# EAGLE design NEW Battery Manager V1 (EAGLE 5.12)

## Sheet 1 of 2
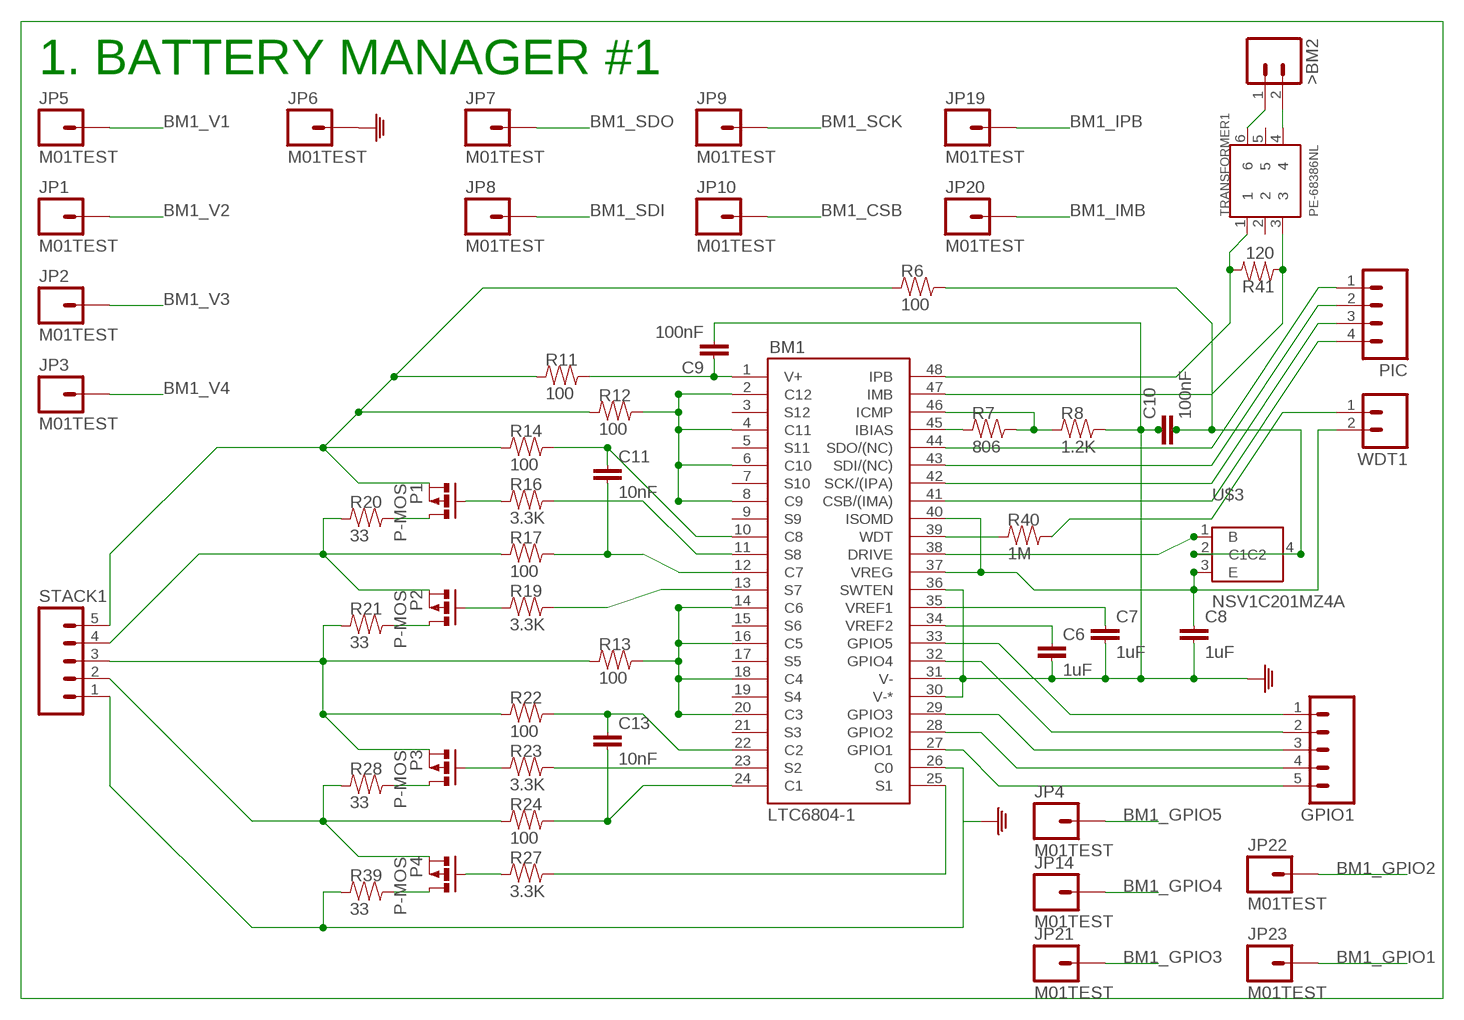
[diagram p0: schematic, sheet 1]

### Parts
>BM2  M02PTH  [1X02]
BM1  LTC6804-1  [SSOP-48]
C6  1uF  CAP0603  [0603]
C7  1uF  CAP0603  [0603]
C8  1uF  CAP0603  [0603]
C9  100nF  CAP0603  [0603]
C10  100nF  CAP0603  [0603]
C11  10nF  CAP0603  [0603]
C13  10nF  CAP0603  [0603]
GPIO1  M05PTH  [1X05]
JP1  M01TEST  [1X01_TEST]
JP2  M01TEST  [1X01_TEST]
JP3  M01TEST  [1X01_TEST]
JP4  M01TEST  [1X01_TEST]
JP5  M01TEST  [1X01_TEST]
JP6  M01TEST  [1X01_TEST]
JP7  M01TEST  [1X01_TEST]
JP8  M01TEST  [1X01_TEST]
JP9  M01TEST  [1X01_TEST]
JP10  M01TEST  [1X01_TEST]
JP14  M01TEST  [1X01_TEST]
JP19  M01TEST  [1X01_TEST]
JP20  M01TEST  [1X01_TEST]
JP21  M01TEST  [1X01_TEST]
JP22  M01TEST  [1X01_TEST]
JP23  M01TEST  [1X01_TEST]
P1  P-MOS  [SOT23F]
P2  P-MOS  [SOT23F]
P3  P-MOS  [SOT23F]
P4  P-MOS  [SOT23F]
PIC  M04PTH  [1X04]
R6  100  R0603  [0603]
R7  806  R0603  [0603]
R8  1.2K  R0603  [0603]
R11  100  R0603  [0603]
R12  100  R0603  [0603]
R13  100  R0603  [0603]
R14  100  R0603  [0603]
R16  3.3K  R0603  [0603]
R17  100  R0603  [0603]
R19  3.3K  R0603  [0603]
R20  33  R0603  [0603]
R21  33  R0603  [0603]
R22  100  R0603  [0603]
R23  3.3K  R0603  [0603]
R24  100  R0603  [0603]
R27  3.3K  R0603  [0603]
R28  33  R0603  [0603]
R39  33  R0603  [0603]
R40  1M  R0603  [0603]
R41  120  R0603  [0603]
STACK1  M05PTH  [1X05]
TRANSFORMER1  PE-68386NL  [NL]
U$3  NSV1C201MZ4A  [SOT-223]
WDT1  M02PTH  [1X02]

### Nets
BM1_CSB: BM1.41(CSB/(IMA)) JP10.1 PIC.4
BM1_GPIO1: BM1.27(GPIO1) GPIO1.5 JP23.1
BM1_GPIO2: BM1.28(GPIO2) GPIO1.4 JP22.1
BM1_GPIO3: BM1.29(GPIO3) GPIO1.3 JP21.1
BM1_GPIO4: BM1.32(GPIO4) GPIO1.2 JP14.1
BM1_GPIO5: BM1.33(GPIO5) GPIO1.1 JP4.1
BM1_IMB: BM1.47(IMB) JP20.1 R41.1 TRANSFORMER1.3
BM1_IPB: BM1.48(IPB) JP19.1 R41.2 TRANSFORMER1.1
BM1_SCK: BM1.42(SCK/(IPA)) JP9.1 PIC.3
BM1_SDI: BM1.43(SDI/(NC)) JP8.1 PIC.2
BM1_SDO: BM1.44(SDO/(NC)) JP7.1 PIC.1
BM1_V1: JP5.1 P1.S R6.1 R11.1 R12.1 R14.1 STACK1.5
BM1_V2: JP1.1 P2.S R17.1 R20.1 STACK1.4
BM1_V3: JP2.1 P3.S R13.1 R21.1 R22.1 STACK1.3
BM1_V4: JP3.1 P4.S R24.1 R28.1 STACK1.2
GND: BM1.26(C0) BM1.30(V-*) BM1.31(V-) BM1.36(SWTEN) C6.2 C7.2 C8.2 C9.2 C10.1 JP6.1 R8.2 R39.1 STACK1.1
N$7: BM1.46(ICMP) R7.2 R8.1
N$8: BM1.37(VREG) BM1.40(ISOMD) C8.1 U$3.3(E) WDT1.2
N$15: BM1.34(VREF2) C6.1
N$16: BM1.35(VREF1) C7.1
N$17: BM1.1(V+) C9.1 R11.2
N$18: BM1.2(C12) BM1.4(C11) BM1.6(C10) BM1.8(C9) R12.2
N$19: BM1.14(C6) BM1.16(C5) BM1.18(C4) BM1.20(C3) R13.2
N$20: BM1.10(C8) C11.1 R14.2
N$21: BM1.11(S8) R16.2
N$22: P1.G R16.1
N$23: BM1.13(S7) R19.2
N$24: P2.G R19.1
N$27: P1.D R20.2
N$28: P2.D R21.2
N$29: BM1.25(S1) R27.2
N$30: P3.G R23.1
N$31: P3.D R28.2
N$32: P4.G R27.1
N$33: P4.D R39.2
N$34: BM1.24(C1) C13.2 R24.2
N$35: BM1.23(S2) R23.2
N$37: BM1.12(C7) C11.2 R17.2
N$38: BM1.22(C2) C13.1 R22.2
N$40: C10.2 R6.2 U$3.2(C1) U$3.4(C2)
N$43: >BM2.1 TRANSFORMER1.6
N$54: >BM2.2 TRANSFORMER1.4
N$64: BM1.45(IBIAS) R7.1
N$70: BM1.39(WDT) R40.1
N$71: R40.2 WDT1.1
N$72: BM1.38(DRIVE) U$3.1(B)
Unconnected: BM1.3(S12) BM1.5(S11) BM1.7(S10) BM1.9(S9) BM1.15(S6) BM1.17(S5) BM1.19(S4) BM1.21(S3) TRANSFORMER1.2 TRANSFORMER1.5

### Notes on the sheet
- 1. BATTERY MANAGER #1

## Sheet 2 of 2
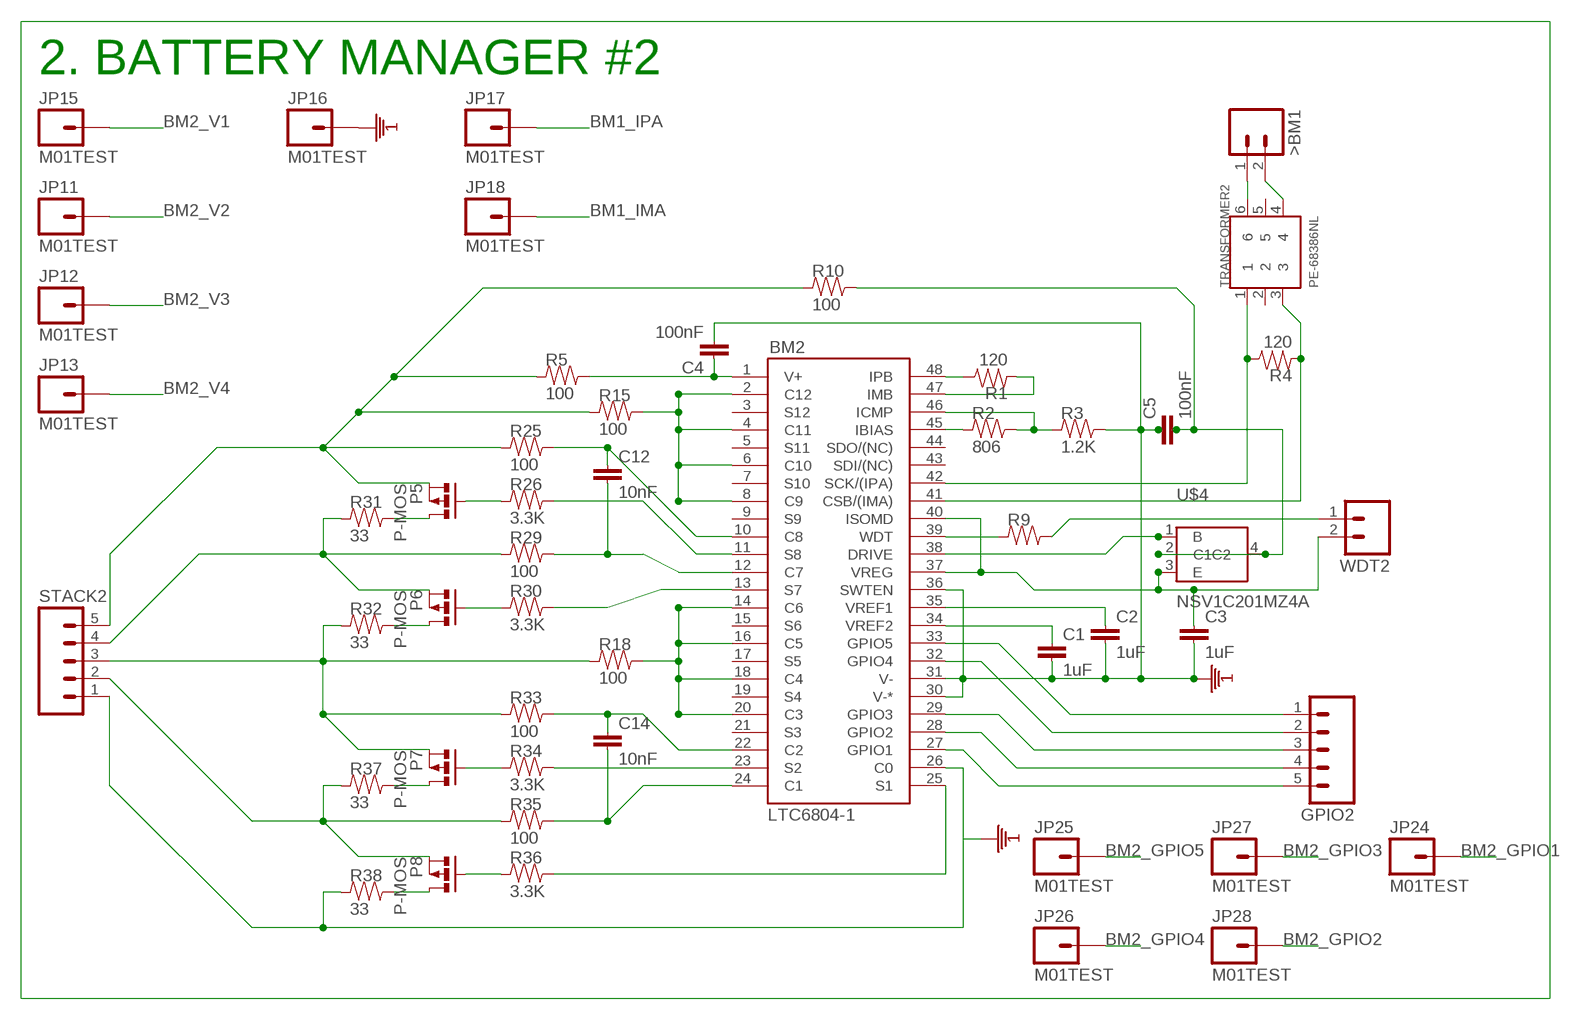
[diagram p1: schematic, sheet 2]

### Parts
>BM1  M02PTH  [1X02]
BM2  LTC6804-1  [SSOP-48]
C1  1uF  CAP0603  [0603]
C2  1uF  CAP0603  [0603]
C3  1uF  CAP0603  [0603]
C4  100nF  CAP0603  [0603]
C5  100nF  CAP0603  [0603]
C12  10nF  CAP0603  [0603]
C14  10nF  CAP0603  [0603]
GPIO2  M05PTH  [1X05]
JP11  M01TEST  [1X01_TEST]
JP12  M01TEST  [1X01_TEST]
JP13  M01TEST  [1X01_TEST]
JP15  M01TEST  [1X01_TEST]
JP16  M01TEST  [1X01_TEST]
JP17  M01TEST  [1X01_TEST]
JP18  M01TEST  [1X01_TEST]
JP24  M01TEST  [1X01_TEST]
JP25  M01TEST  [1X01_TEST]
JP26  M01TEST  [1X01_TEST]
JP27  M01TEST  [1X01_TEST]
JP28  M01TEST  [1X01_TEST]
P5  P-MOS  [SOT23F]
P6  P-MOS  [SOT23F]
P7  P-MOS  [SOT23F]
P8  P-MOS  [SOT23F]
R1  120  R0603  [0603]
R2  806  R0603  [0603]
R3  1.2K  R0603  [0603]
R4  120  R0603  [0603]
R5  100  R0603  [0603]
R9  R0603  [0603]
R10  100  R0603  [0603]
R15  100  R0603  [0603]
R18  100  R0603  [0603]
R25  100  R0603  [0603]
R26  3.3K  R0603  [0603]
R29  100  R0603  [0603]
R30  3.3K  R0603  [0603]
R31  33  R0603  [0603]
R32  33  R0603  [0603]
R33  100  R0603  [0603]
R34  3.3K  R0603  [0603]
R35  100  R0603  [0603]
R36  3.3K  R0603  [0603]
R37  33  R0603  [0603]
R38  33  R0603  [0603]
STACK2  M05PTH  [1X05]
TRANSFORMER2  PE-68386NL  [NL]
U$4  NSV1C201MZ4A  [SOT-223]
WDT2  M02PTH  [1X02]

### Nets
BM1_IMA: BM2.41(CSB/(IMA)) JP18.1 R4.1 TRANSFORMER2.3
BM1_IPA: BM2.42(SCK/(IPA)) JP17.1 R4.2 TRANSFORMER2.1
BM2_GPIO1: BM2.27(GPIO1) GPIO2.5 JP24.1
BM2_GPIO2: BM2.28(GPIO2) GPIO2.4 JP28.1
BM2_GPIO3: BM2.29(GPIO3) GPIO2.3 JP27.1
BM2_GPIO4: BM2.32(GPIO4) GPIO2.2 JP26.1
BM2_GPIO5: BM2.33(GPIO5) GPIO2.1 JP25.1
BM2_V1: JP15.1 P5.S R5.1 R10.1 R15.1 R25.1 STACK2.5
BM2_V2: JP11.1 P6.S R29.1 R31.1 STACK2.4
BM2_V3: JP12.1 P7.S R18.1 R32.1 R33.1 STACK2.3
BM2_V4: JP13.1 P8.S R35.1 R37.1 STACK2.2
GND1: BM2.26(C0) BM2.30(V-*) BM2.31(V-) BM2.36(SWTEN) C1.2 C2.2 C3.2 C4.2 C5.1 JP16.1 R3.2 R38.1 STACK2.1
N$1: BM2.46(ICMP) R2.2 R3.1
N$2: BM2.45(IBIAS) R2.1
N$3: >BM1.1 TRANSFORMER2.6
N$4: BM2.34(VREF2) C1.1
N$5: BM2.35(VREF1) C2.1
N$6: BM2.1(V+) C4.1 R5.2
N$9: BM2.2(C12) BM2.4(C11) BM2.6(C10) BM2.8(C9) R15.2
N$10: BM2.14(C6) BM2.16(C5) BM2.18(C4) BM2.20(C3) R18.2
N$11: BM2.10(C8) C12.1 R25.2
N$12: BM2.11(S8) R26.2
N$14: P5.G R26.1
N$25: BM2.13(S7) R30.2
N$36: P6.G R30.1
N$39: P5.D R31.2
N$41: P6.D R32.2
N$42: >BM1.2 TRANSFORMER2.4
N$44: BM2.25(S1) R36.2
N$45: P7.G R34.1
N$46: P7.D R37.2
N$47: P8.G R36.1
N$48: P8.D R38.2
N$49: BM2.24(C1) C14.2 R35.2
N$50: BM2.23(S2) R34.2
N$51: BM2.12(C7) C12.2 R29.2
N$52: BM2.22(C2) C14.1 R33.2
N$53: BM2.38(DRIVE) U$4.1(B)
N$55: BM2.47(IMB) R1.1
N$56: BM2.48(IPB) R1.2
N$62: R9.2 WDT2.1
N$63: BM2.39(WDT) R9.1
N$75: BM2.37(VREG) BM2.40(ISOMD) C3.1 U$4.3(E) WDT2.2
N$76: C5.2 R10.2 U$4.2(C1) U$4.4(C2)
Unconnected: BM2.3(S12) BM2.5(S11) BM2.7(S10) BM2.9(S9) BM2.15(S6) BM2.17(S5) BM2.19(S4) BM2.21(S3) BM2.43(SDI/(NC)) BM2.44(SDO/(NC)) TRANSFORMER2.2 TRANSFORMER2.5

### Notes on the sheet
- 2. BATTERY MANAGER #2

## Library data of the parts
>BM1 >BM2 WDT1 WDT2 = GibbotV5:M02: Header 2 Standard 2-pin 0.1" header. Use with straight break away headers (SKU : PRT-00116), right angle break away headers (PRT-00553), swiss pins (PRT-00743), machine pins (PRT-00117), and female headers (PRT-00115). Molex polarized connector foot print use with SKU : PRT-08233 with associated crimp pins and housings.
BM1 BM2 = LTC:LTC6804-1
C1-C14 = GibbotV5:CAP: Capacitor Standard 0603 ceramic capacitor, and 0.1" leaded capacitor.
GPIO1 GPIO2 STACK1 STACK2 = GibbotV5:M05: Header 5 Standard 5-pin 0.1" header. Use with straight break away headers (SKU : PRT-00116), right angle break away headers (PRT-00553), swiss pins (PRT-00743), machine pins (PRT-00117), and female headers (PRT-00115). Molex polarized connector foot print use with SKU : PRT-08230 with associated crimp pins and housings.
JP1-JP28 = GibbotV5:M01: Header 1 Standard 1-pin 0.1" header. Use with straight break away headers (SKU : PRT-00116), right angle break away headers (PRT-00553), swiss pins (PRT-00743), machine pins (PRT-00117), and female headers (PRT-00115).
P1-P8 = GibbotV5:P-MOS
PIC = GibbotV5:M04: Header 4 Standard 4-pin 0.1" header. Use with straight break away headers (SKU : PRT-00116), right angle break away headers (PRT-00553), swiss pins (PRT-00743), machine pins (PRT-00117), and female headers (PRT-00115). Molex polarized connector foot print use with SKU : PRT-08231 with associated crimp pins and housings. 1MM SMD Version SKU: PRT-10208
R1-R41 = GibbotV5:R: RESISTOR, American symbol
TRANSFORMER1 TRANSFORMER2 = LTC:PE-68386NL
U$3 U$4 = LTC:NSV1C201MZ4

## Board
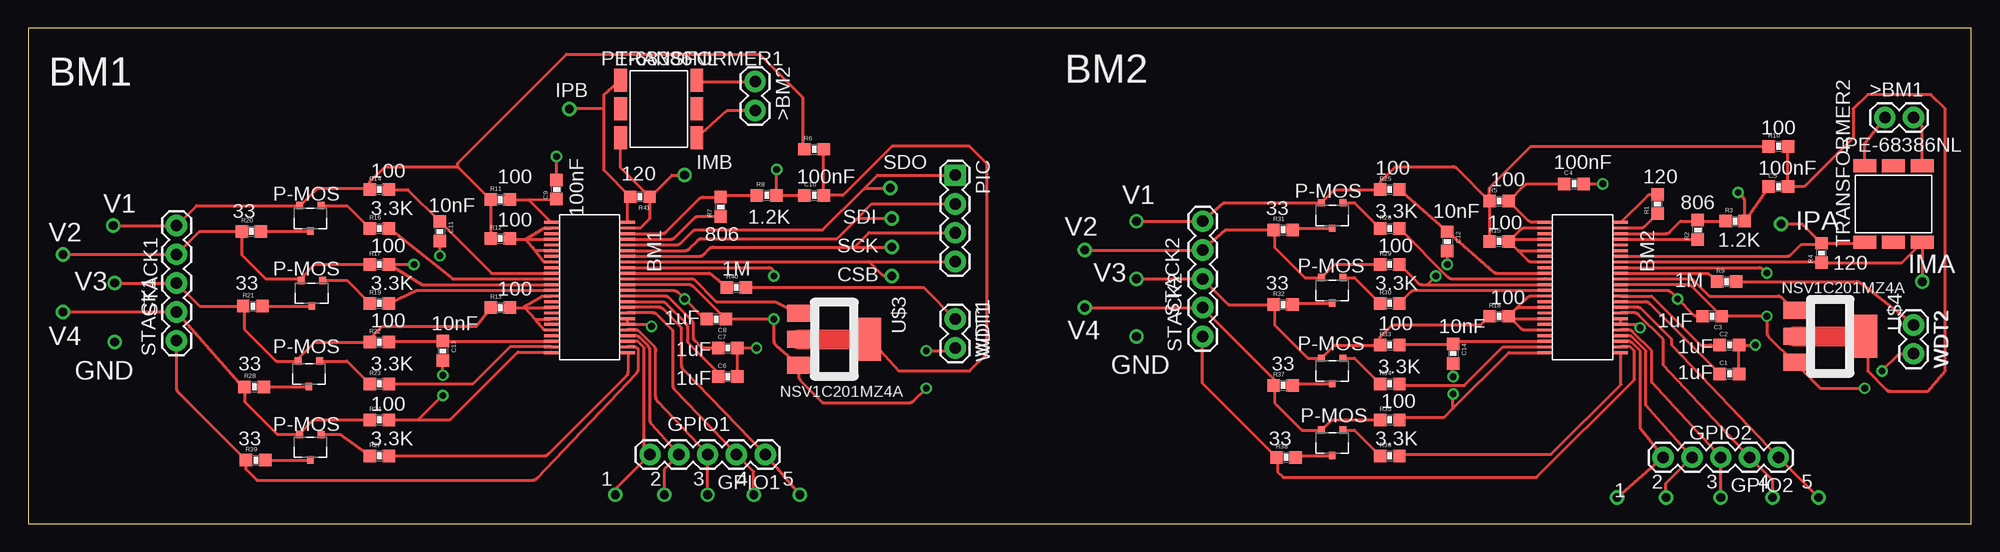
[diagram p2: board, top side]
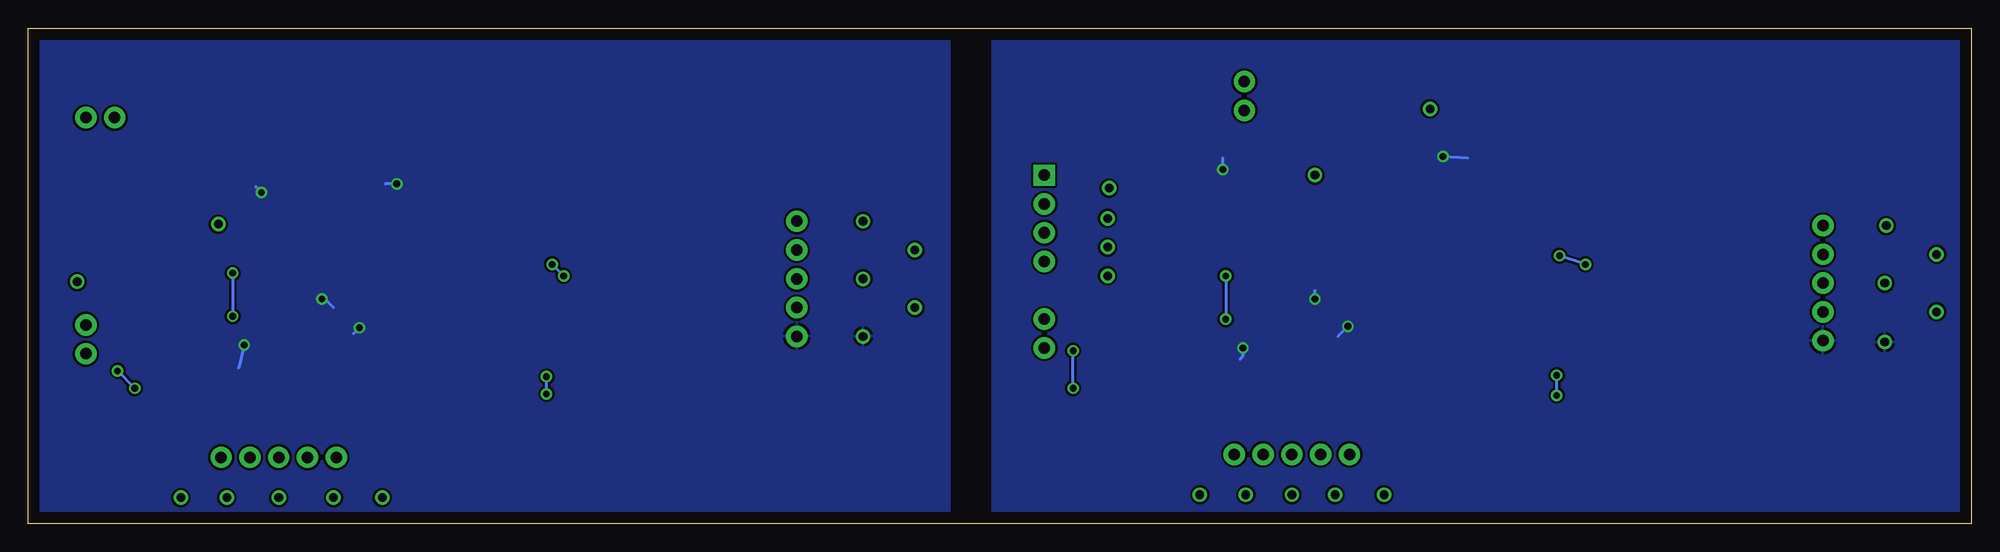
[diagram p3: board, bottom side, seen from below]

Size 171.45 x 43.69 mm. Coordinates in mm from the lower left corner, seen from the top.
Outline: 0,0 171.45,0 171.45,43.69 0,43.69 0,0
Copper layers (1*16): Top 0.035mm / dielectric 1.5mm / Bottom 0.035mm
Design rules "default": minimum track width 10mil, minimum drill 24mil, track to track 8mil, track to pad 8mil, pad to pad 8mil, via to via 8mil, smd to smd 8mil, copper to edge 40mil, drill to drill 8mil, minimum pad ring 10mil, minimum via ring 8mil, stop-mask expansion 4mil, vias tented up to drill 0mil, thermal gap 10mil

### Footprints (pad centres in the part's own frame; a part is rotated, then mirrored left to right if it is on the bottom)
1X02 = drill 1.016 pad 1.88 round: 1 0,0; 2 2.54,0
SSOP-48 = smd 0.25 x 1.25: 1 -5.75,-3.375; 2 -5.25,-3.375; 3 -4.75,-3.375; 4 -4.25,-3.375; 5 -3.75,-3.375; 6 -3.25,-3.375; 7 -2.75,-3.375; 8 -2.25,-3.375; 9 -1.75,-3.375; 10 -1.25,-3.375; 11 -0.75,-3.375; 12 -0.25,-3.375; 13 0.25,-3.375; 14 0.75,-3.375; 15 1.25,-3.375; 16 1.75,-3.375; 17 2.25,-3.375; 18 2.75,-3.375; 19 3.25,-3.375; 20 3.75,-3.375; 21 4.25,-3.375; 22 4.75,-3.375; 23 5.25,-3.375; 24 5.75,-3.375; 25 5.75,3.375; 26 5.25,3.375; 27 4.75,3.375; 28 4.25,3.375; 29 3.75,3.375; 30 3.25,3.375; 31 2.75,3.375; 32 2.25,3.375; 33 1.75,3.375; 34 1.25,3.375; 35 0.75,3.375; 36 0.25,3.375; 37 -0.25,3.375; 38 -0.75,3.375; 39 -1.25,3.375; 40 -1.75,3.375; 41 -2.25,3.375; 42 -2.75,3.375; 43 -3.25,3.375; 44 -3.75,3.375; 45 -4.25,3.375; 46 -4.75,3.375; 47 -5.25,3.375; 48 -5.75,3.375
0603 = smd 1.1 x 1.1: 1 -0.85,0; 2 0.85,0
1X05 = drill 1.016 pad 1.88 round: 1 0,0; 2 2.54,0; 3 5.08,0; 4 7.62,0; 5 10.16,0
1X01_TEST = drill 0.762 round: 1 0,0
SOT23F = smd 0.6 x 0.65: D 0,1.125; G -0.95,-1.125; S 0.95,-1.125
1X04 = drill 1.016 pad 1.88 square: 1 0,0 | drill 1.016 pad 1.88 round: 2 2.54,0; 3 5.08,0; 4 7.62,0
NL = smd 1.143 x 2.032: 1 -3.365,2.54; 2 -3.365,0; 3 -3.365,-2.54; 4 3.365,-2.54; 5 3.365,0; 6 3.365,2.54
SOT-223 = smd 1.5 x 2: 1 -2.3,-3.15; 2 0,-3.15; 3 2.3,-3.15 | smd 3.8 x 2: 4 0,3.15

### Placement (x,y rotation side)
>BM1  163.83,35.81 0 top
>BM2  64.14,38.99 270 top
BM1  49.53,20.83 270 top
BM2  137.16,20.83 270 top
C1  150.11,13.21 0 top
C2  150.11,15.75 0 top
C3  148.59,18.29 180 top
C4  136.4,29.97 0 top
C5  154.43,29.72 0 top
C6  61.72,12.95 0 top
C7  61.72,15.49 0 top
C8  60.71,18.03 180 top
C9  46.61,29.46 90 top
C10  69.34,28.96 0 top
C11  36.32,25.78 270 top
C12  125.22,24.89 270 top
C13  36.58,15.24 270 top
C14  125.73,14.99 270 top
GPIO1  65.02,6.1 180 top
GPIO2  154.43,5.84 180 top
JP1  3.05,23.75 0 top
JP2  7.62,21.21 0 top
JP3  3.05,18.67 0 top
JP4  68.07,2.54 270 top
JP5  7.49,26.29 0 top
JP6  7.62,16 0 top
JP7  76.07,29.59 0 top
JP8  76.2,26.92 0 top
JP9  76.2,24.38 0 top
JP10  76.2,21.84 0 top
JP11  93.22,24.13 0 top
JP12  97.79,21.59 0 top
JP13  93.22,19.05 0 top
JP14  64.01,2.54 270 top
JP15  97.79,26.67 0 top
JP16  97.79,16.51 0 top
JP17  154.69,26.42 0 top
JP18  167.13,21.34 0 top
JP19  47.75,36.58 0 top
JP20  57.91,30.73 0 top
JP21  59.94,2.54 270 top
JP22  56.13,2.54 270 top
JP23  51.82,2.54 270 top
JP24  140.21,2.29 90 top
JP25  157.99,2.29 90 top
JP26  153.92,2.29 90 top
JP27  149.35,2.29 90 top
JP28  144.53,2.29 90 top
P1  24.89,26.92 180 top
P2  25.02,20.32 180 top
P3  24.77,13.21 180 top
P4  24.89,6.73 180 top
P5  115.06,27.18 180 top
P6  115.06,20.57 180 top
P7  115.06,13.46 180 top
P8  115.06,7.11 180 top
PIC  81.79,30.73 270 top
R1  143.76,28.19 90 top
R2  147.32,25.91 90 top
R3  150.62,26.67 0 top
R4  158.24,23.88 90 top
R5  129.79,28.45 0 top
R6  69.34,33.02 0 top
R7  61.09,27.94 90 top
R8  65.15,28.96 0 top
R9  149.86,21.34 0 top
R10  154.43,33.27 0 top
R11  41.66,28.57 0 top
R12  41.66,25.15 0 top
R13  41.66,19.05 0 top
R14  30.99,29.46 0 top
R15  129.79,24.89 0 top
R16  30.99,26.04 0 top
R17  30.99,22.86 0 top
R18  129.79,18.29 0 top
R19  30.99,19.43 0 top
R20  19.68,25.78 0 top
R21  19.81,19.18 0 top
R22  30.99,16 0 top
R23  30.99,12.32 0 top
R24  30.99,9.14 0 top
R25  120.14,29.46 0 top
R26  120.14,26.04 0 top
R27  30.99,5.97 0 top
R28  19.94,12.06 0 top
R29  120.14,22.86 0 top
R30  120.14,19.43 0 top
R31  110.74,25.91 0 top
R32  110.74,19.3 0 top
R33  120.14,15.75 0 top
R34  120.14,12.32 0 top
R35  120.14,9.14 0 top
R36  120.14,5.97 0 top
R37  110.74,12.19 0 top
R38  111,5.84 0 top
R39  20.07,5.59 0 top
R40  62.48,20.83 0 top
R41  53.98,28.83 180 top
STACK1  13.08,16.13 90 top
STACK2  103.63,16.51 90 top
TRANSFORMER1  55.63,36.58 0 top
TRANSFORMER2  164.59,28.19 90 top
U$3  71.12,16.26 270 top
U$4  159,16.51 270 top
WDT1  81.79,18.03 270 top
WDT2  166.37,17.53 270 top

### Tracks (layer width: path | path; a pad name or v marks a point on that pad's centre or on a via)
BM1_CSB
  Top 0.254: BM1.41 52.94,23.11 74.17,23.11 | 74.17,23.11 PIC.4 | JP10.1 75.65,21.84 arc-45 75.29,21.99 74.17,23.11
BM1_GPIO1
  Top 0.254: JP23.1 51.82,3.05 GPIO1.5 54.36,6.6 54.36,15.49 53.77,16.08 BM1.27
BM1_GPIO2
  Top 0.254: BM1.28 53.57,16.58 arc-45 53.93,16.43 54.68,15.68 arc-45 54.86,15.23 54.86,9.15 arc45 55.05,8.7 GPIO1.4 56.13,4.83 JP22.1
BM1_GPIO3
  Top 0.254: BM1.29 53.58,17.08 arc-45 53.94,16.93 55.19,15.68 arc-45 55.37,15.23 55.37,11.19 arc45 55.56,10.74 GPIO1.3 JP21.1
BM1_GPIO4
  Top 0.254: BM1.32 55.13,18.58 arc-45 55.48,18.43 56.9,17.02 56.9,12.15 arc45 57.05,11.79 GPIO1.2 64.01,4.57 JP14.1
BM1_GPIO5
  Top 0.254: BM1.33 55.64,19.08 arc-45 56,18.93 57.66,17.27 57.66,13.93 arc45 57.81,13.57 GPIO1.1 JP4.1
BM1_IMA
  Top 0.254: JP18.1 TRANSFORMER2.3 165.33,23.03 R4.1 158.19,23.08 BM2.41
BM1_IMB
  Top 0.254: BM1.47 54.02,26.08 54.86,26.92 54.86,28.79 | 54.86,28.79 R41.1 52.26,31.39 TRANSFORMER1.3 | 54.86,28.79 56.81,30.73 JP20.1
BM1_IPA
  Top 0.254: BM2.42 155.19,23.58 arc45 155.55,23.73 156.46,24.64 158.15,24.64 R4.2 | R4.2 161.95,24.73 TRANSFORMER2.1 | JP17.1 156.55,26.42 R4.2
BM1_IPB
  Top 0.254: BM1.48 52.91,28.61 R41.2 50.8,31.15 50.8,36.58 | 50.8,36.58 50.8,37.85 TRANSFORMER1.1 | 50.8,36.58 JP19.1
BM1_SCK
  Top 0.254: BM1.42 59.23,23.58 arc45 59.59,23.73 60.09,24.23 arc-45 60.45,24.38 72.9,24.38 | 72.9,24.38 74.17,25.65 PIC.3 | 72.9,24.38 JP9.1
BM1_SDI
  Top 0.254: BM1.43 57.96,24.08 arc45 58.31,24.23 59.09,25 arc-45 59.44,25.15 71.37,25.15 73,26.77 | 73,26.77 74.42,28.19 PIC.2 | JP8.1 73.36,26.92 arc45 73,26.77
BM1_SDO
  Top 0.254: BM1.44 57.19,24.58 arc45 57.55,24.73 58.59,25.76 arc-45 58.94,25.91 70.1,25.91 73.64,29.44 | 73.64,29.44 74.93,30.73 PIC.1 | JP7.1 74,29.59 arc45 73.64,29.44
BM1_V1
  Top 0.254: R12.1 R11.1 37.88,31.5 | 37.88,31.5 31.5,31.5 30.14,30.14 R14.1 30.01,29.59 25.53,29.59 23.98,28.05 P1.S 14.84,28.05 STACK1.5 JP5.1 | 37.88,31.5 37.88,31.79 47.5,41.4 64.52,41.4 68.33,37.59 68.33,33.19 R6.1
BM1_V2
  Top 0.254: R17.1 25.27,22.86 24.07,21.66 P2.S 23.92,21.59 20.95,21.59 18.84,23.71 R20.1 15.11,25.78 STACK1.4 JP1.1
BM1_V3
  Top 0.254: R13.1 39.54,17.4 31.24,17.4 30.14,16.3 R22.1 25.27,16 23.82,14.54 P3.S 21.86,14.33 19.05,17.14 19.05,19.09 R21.1 15.11,19.18 STACK1.3 JP2.1
BM1_V4
  Top 0.254: R24.1 25.15,9.14 23.94,7.94 P4.S 23.92,7.87 21.97,7.87 19.09,10.76 R28.1 18.92,12.06 STACK1.2 JP3.1
BM2_GPIO1
  Top 0.254: BM2.27 141.19,16.08 arc-45 141.55,15.93 142.24,15.24 142.24,8.38 GPIO2.5 JP24.1
BM2_GPIO2
  Top 0.254: BM2.28 141.2,16.58 arc-45 141.56,16.43 142.75,15.24 142.75,10.41 GPIO2.4 144.53,3.56 JP28.1
BM2_GPIO3
  Top 0.254: BM2.29 141.21,17.08 arc-45 141.57,16.93 143.26,15.24 143.26,12.45 GPIO2.3 JP27.1
BM2_GPIO4
  Top 0.254: BM2.32 141.74,18.58 arc-45 142.1,18.43 144.27,16.26 144.27,13.97 GPIO2.2 153.92,3.81 JP26.1
BM2_GPIO5
  Top 0.254: BM2.33 141.75,19.08 arc-45 142.36,18.93 145.03,16.26 145.03,15.75 GPIO2.1 JP25.1
BM2_V1
  Top 0.254: R5.1 R15.1 | R5.1 126.05,31.35 arc45 125.69,31.5 120.65,31.5 119.44,30.29 arc45 119.29,29.93 R25.1 115.27,29.46 P5.S 105.52,28.3 STACK2.5 JP15.1 | R10.1 132.59,33.27 128.94,29.63 R5.1
BM2_V2
  Top 0.254: R29.1 115.27,22.86 P6.S 112.67,21.7 109.98,24.38 109.98,25.82 R31.1 105.66,25.91 STACK2.4 JP11.1
BM2_V3
  Top 0.254: R18.1 128.18,17.53 120.4,17.53 119.29,16.42 R33.1 115.27,15.75 P7.S 112.92,14.59 109.98,17.53 109.98,19.22 R32.1 105.92,19.3 STACK2.3 JP12.1
BM2_V4
  Top 0.254: R35.1 115.02,9.14 P8.S 112.41,8.24 109.98,10.67 109.98,12.1 R37.1 109.89,12.79 STACK2.2 JP13.1
GND  (via drill 0.6)
  Top 0.254: C9.2 v46.61,32.38 | C10.1 R8.2 arc90 66.04,29 v66.04,31.24 | BM1.36 56.63,20.58 arc-45 56.64,20.57 56.89,20.57 arc-45 57.34,20.39 v57.91,19.81 59.5,18.22 arc45 59.95,18.03 C8.2 | C6.2 C7.2 v64.26,15.49 | BM1.31 BM1.30 54.6,17.58 arc-45 54.96,17.43 v55,17.39 | BM1.26 53.47,15.58 arc-90 53.85,15.2 53.85,13.72 arc-45 53.66,13.28 44.89,4 arc-45 44.44,3.81 20.19,3.81 19.22,4.79 R39.1 13.27,11.54 arc-45 13.08,11.99 STACK1.1
  Bottom 0.254: v46.61,32.38 44.45,32.26 | v66.04,31.24 66.04,32.26 | v57.91,19.81 57.91,20.57 | v64.26,15.49 64.26,14.99 arc45 64.45,14.55 64.52,14.48 | v55,17.39 55.88,16.51
  pour Bottom: 0.51,43.18 86.36,43.18 86.36,0.51 0.51,0.51
GND1  (via drill 0.6)
  Top 0.254: BM2.26 141.39,15.58 141.73,15.24 141.73,12.7 133.1,4.06 110.74,4.06 110.24,4.57 110.24,5.5 R38.1 103.63,12.36 103.63,16 | C4.2 v138.94,29.97 | v142.24,17.27 142.08,17.43 arc45 141.72,17.58 BM2.30 BM2.31 | C5.1 R3.2 151.47,28.49 arc45 v150.88,29.21 | C1.2 C2.2 v152.4,15.75 | BM2.36 144.57,20.58 arc-45 144.93,20.43 v145.54,19.81 146.92,18.44 arc45 147.28,18.29 C3.2
  Top 0.406: 103.63,16 STACK2.1
  Bottom 0.254: v138.94,29.97 139.95,29.97 | v142.24,17.27 142.75,16.76 | v152.4,15.75 152.91,13.72 | v145.54,19.81 145.5,19.81 arc45 145.14,19.66 144.53,19.05 | v150.88,29.21 151.38,29.72
  pour Bottom: 90.17,43.18 170.94,43.18 170.94,0.51 90.17,0.51
N$1
  Top 0.254: BM2.46 144.49,25.58 arc45 144.85,25.73 145.8,26.67 147.11,26.67 arc45 R2.2 arc45 147.53,26.67 R3.1
N$2
  Top 0.254: BM2.45 147.27,25.08 arc-45 R2.1
N$3
  Top 0.254: TRANSFORMER2.6 162.05,33.53 >BM1.1
N$4
  Top 0.254: BM2.34 142.68,19.58 arc-45 143.04,19.43 C1.1
N$5
  Top 0.254: BM2.35 arc45 140.56,20.07 143.26,20.07 147.57,15.75 148.38,15.75 arc-45 148.74,15.6 148.84,15.49
  Top 0.406: 148.84,15.49 149.26,15.49 C2.1
N$6
  Top 0.254: BM2.1 132.72,26.58 arc-45 132.37,26.73 R5.2 132.02,29.82 arc-45 132.38,29.97 C4.1
N$7
  Top 0.254: BM1.46 55.92,25.58 arc45 56.28,25.73 59.2,28.64 arc-45 59.56,28.79 R7.2 61.25,28.96 R8.1
N$8  (via drill 0.6)
  Top 0.254: BM1.40 65.31,22.58 arc-90 65.79,22.1 v65.79,21.84 | BM1.37 58.25,21.08 arc-45 58.7,20.89 C8.1 v65.79,18.03 65.79,16.15 arc45 65.97,15.7 U$3.3 67.97,13.01 arc45 68.12,12.65 70.1,10.67 77.77,10.67 arc45 78.13,10.82 v79.25,11.94 | v79.25,15.24 81.32,15.24 arc45 81.68,15.39 WDT1.2
  Bottom 0.254: v65.79,21.84 v65.79,18.03 | v79.25,11.94 v79.25,15.24
N$9
  Top 0.254: BM2.2 132.04,26.08 arc45 131.68,25.93 R15.2 | BM2.4 131.04,25.08 arc45 130.68,24.93 R15.2 | BM2.8 132.67,23.08 arc-45 132.31,23.23 131.49,24.05 | R15.2 131.49,24.05 | BM2.6 131.56,24.08 arc45 131.49,24.05
N$10
  Top 0.254: BM2.14 132.64,20.08 arc45 132.28,19.93 131.28,18.93 | BM2.16 131.64,19.08 arc45 131.28,18.93 | R18.2 131.28,18.93 | BM2.18 131.06,18.08 arc-45 130.71,18.23 R18.2 | BM2.20 132.06,17.08 arc-45 131.71,17.23 R18.2
N$11
  Top 0.254: R25.2 C12.1 129.25,22.23 arc45 129.6,22.08 BM2.10
N$12
  Top 0.254: BM2.11 133.83,21.58 arc45 133.86,21.59 125.65,21.59 arc-45 125.29,21.74 R26.2
N$14
  Top 0.254: P5.G 117.02,28.3 R26.1
N$15
  Top 0.254: BM1.34 arc45 52.95,19.56 55.92,19.56 arc-45 56.28,19.41 57.98,17.71 arc-45 58.17,17.26 58.17,16.21 arc45 58.31,15.85 60.87,13.3 C6.1
N$16
  Top 0.254: BM1.35 56.17,20.08 arc-45 56.52,19.93 58.52,17.93 arc-45 58.67,17.57 58.67,16.47 arc45 58.82,16.11 59.29,15.64 arc45 59.65,15.49 C7.1
N$17
  Top 0.254: 44.16,28.57 BM1.1 | R11.2 44.16,28.57 | 44.16,28.57 C9.1
N$18
  Top 0.254: BM1.2 46.11,26.04 45.47,26.04 43.88,25.08 | 43.88,25.08 BM1.4 | BM1.6 46.1,24.13 44.7,24.13 | 43.88,25.08 44.7,24.13 | BM1.8 46.12,23.11 45.47,23.11 44.7,24.13 | 43.88,25.08 42.57,25.08 R12.2
N$19
  Top 0.254: BM1.20 45.53,17.08 44.7,18.03 | 44.7,18.03 46.11,18.03 BM1.18 | 43.81,19.05 44.7,18.03 | 43.81,19.05 46.13,19.05 BM1.16 | 43.81,19.05 43.81,19.18 45.34,20.07 46.14,20.07 BM1.14 | R13.2 43.81,19.05
N$20
  Top 0.254: R14.2 33.49,29.46 C11.1 40.88,22.08 BM1.10
N$21
  Top 0.254: BM1.11 37.44,21.58 R16.2
N$22
  Top 0.254: R16.1 28.12,28.05 P1.G
N$23
  Top 0.254: BM1.13 34.26,20.58 R19.2
N$24
  Top 0.254: R19.1 28.12,21.45 P2.G
N$25
  Top 0.254: BM2.13 122.35,20.58 arc45 121.99,20.43 R30.2
N$27
  Top 0.254: R20.2 20.55,25.8 P1.D
N$28
  Top 0.254: P2.D 25,19.18 R21.2
N$29
  Top 0.254: BM1.25 52.96,15.02 52.96,13.47 arc-45 52.77,13.02 45.87,6.12 arc-45 45.51,5.97 R27.2
N$30
  Top 0.254: R23.1 28.12,14.33 P3.G
N$31
  Top 0.254: R28.2 20.81,12.08 P3.D
N$32
  Top 0.254: R27.1 27.49,7.86 P4.G
N$33
  Top 0.254: R39.2 24.87,5.59 P4.D
N$34  (via drill 0.6)
  Top 0.254: BM1.24 46.12,15.11 43.18,15.11 37.21,9.14 34.42,9.14 | v36.58,13.08 C13.2 | 34.42,9.14 v36.58,11.3 | R24.2 34.42,9.14
  Bottom 0.254: v36.58,11.3 v36.58,13.08
N$35
  Top 0.254: BM1.23 46.11,15.62 42.55,15.62 39.24,12.32 R23.2
N$36
  Top 0.254: P6.G 117.02,21.7 R30.1
N$37  (via drill 0.6)
  Top 0.254: BM1.12 34.76,21.08 R17.2 v34.04,22.86 | v36.32,23.62 C11.2
  Bottom 0.254: v34.04,22.86 v36.32,23.62
N$38
  Top 0.254: BM1.22 36.82,16.08 C13.1 31.93,16.09 R22.2
N$39
  Top 0.254: P5.D 111.74,26.05 R31.2
N$40
  Top 0.254: U$3.4 76.81,13.46 83.06,13.46 84.58,14.99 84.58,31.75 83.06,33.27 76.2,33.27 71.88,28.96 C10.2 R6.2
  Top 1.778: U$3.2 U$3.4
N$41
  Top 0.254: P6.D 111.74,19.45 R32.2
N$42
  Top 0.254: TRANSFORMER2.4 167.13,35.05 >BM1.2
N$43
  Top 0.254: TRANSFORMER1.6 59.12,38.99 >BM2.1
N$44
  Top 0.254: BM2.25 140.53,12.27 134.37,6.1 121.12,6.1 R36.2
N$45
  Top 0.254: P7.G 117.02,14.59 R34.1
N$46
  Top 0.254: P7.D 111.7,12.34 R37.2
N$47
  Top 0.254: P8.G 117.02,8.24 R36.1
N$48
  Top 0.254: P8.D 112.25,5.99 R38.2
N$49  (via drill 0.6)
  Top 0.254: BM2.24 130.65,15.08 125.73,10.16 | 125.73,10.16 124.97,9.4 121.25,9.4 R35.2 | v125.73,12.95 C14.2 | 125.73,10.16 v125.73,11.43
  Bottom 0.254: v125.73,11.43 v125.73,12.95
N$50
  Top 0.254: BM2.23 130.13,15.58 126.75,12.19 121.12,12.19 R34.2
N$51  (via drill 0.6)
  Top 0.254: 123.44,21.08 122.98,21.08 arc-45 122.62,21.23 R29.2 | 123.44,21.08 BM2.12 | v125.22,22.86 C12.2 | v124.21,21.84 123.44,21.08
  Bottom 0.254: v124.21,21.84 v125.22,22.86
N$52
  Top 0.254: BM2.22 125.97,16.08 C14.1 121.08,15.84 R33.2
N$53
  Top 0.254: BM2.38 146.61,21.58 arc-45 146.97,21.43 148.34,20.07 154.39,20.07 arc-45 154.75,19.92 U$4.1
N$54
  Top 0.254: TRANSFORMER1.4 61.66,36.45 >BM2.2
N$55
  Top 0.254: BM2.47 142.28,26.07 arc45 142.64,26.22 R1.1
N$56
  Top 0.254: R1.2 143.21,29.04 arc45 142.85,28.89 BM2.48
N$62
  Top 0.254: R9.2 161.33,21.34 arc-45 161.69,21.19 WDT2.1
N$63
  Top 0.254: BM2.39 148.06,22.08 arc-45 148.42,21.93 R9.1
N$64
  Top 0.254: BM1.45 56.69,25.08 arc45 57.05,25.23 58.76,26.94 arc-45 59.12,27.09 R7.1
N$70
  Top 0.254: BM1.39 53.14,22.1 60.11,22.1 R40.1
N$71
  Top 0.254: R40.2 78.99,20.83 WDT1.1
N$72
  Top 0.254: BM1.38 58.69,21.58 60.71,19.56 65.95,19.56 U$3.1
N$75  (via drill 0.6)
  Top 0.254: BM2.37 146.44,21.08 arc-45 146.8,20.93 C3.1 | BM2.40 152.73,22.58 arc-45 153.09,22.43 v153.42,22.1 | C3.1 149.8,17.93 | C3.1 v153.42,18.29 153.42,16.86 arc45 153.56,16.5 U$4.3 158.13,11.94 v162.05,11.94 | v163.58,13.46 165.1,14.99 WDT2.2
  Bottom 0.254: v153.42,22.1 v153.42,18.29 | v162.05,11.94 v163.58,13.46
N$76
  Top 0.254: 163.94,11.83 arc45 164.29,11.68 | 163.94,11.83 162.31,13.46 162.31,16.15 arc45 U$4.4 | R10.2 C5.2 156.72,29.72 161.04,34.04 161.04,36.58 162.31,37.85 167.89,37.85 169.16,36.58 169.16,13.46 167.64,11.68 164.08,11.68 163.94,11.83
  Top 1.778: U$4.2 U$4.4

### Text on the board
tPlace: PE-68386NL | BM1 | BM2 | IPB | 100 | PE-68386NL | 100nF | IMB | SDO | 100 | 100nF | 100nF | 100 | 100 | 120 | 100nF | 100 | 120 | P-MOS | P-MOS | V1 | 806 | V1 | 33 | 3.3K | 10nF | 33 | 3.3K | 10nF | 100 | 1.2K | SDI | 100 | IPA | V2 | 806 | V2 | 100 | SCK | 100 | 1.2K | P-MOS | 1M | P-MOS | 120 | IMA | V3 | 33 | 3.3K | CSB | V3 | 33 | 3.3K | 1M | 100 | WDT1 | NSV1C201MZ4A | 100 | WDT2 | STACK1 | 1uF | STACK2 | 100 | 10nF | 100 | 10nF | 1uF | V4 | V4 | P-MOS | 1uF | P-MOS | 1uF | GND | 33 | 3.3K | GND | 33 | 3.3K | 1uF | 1uF | NSV1C201MZ4A | 100 | 100 | P-MOS | P-MOS | GPIO1 | 33 | 3.3K | 33 | 3.3K | GPIO2 | 1 | 2 | 3 | 4 | 5 | 2 | 3 | 4 | 5 | 1